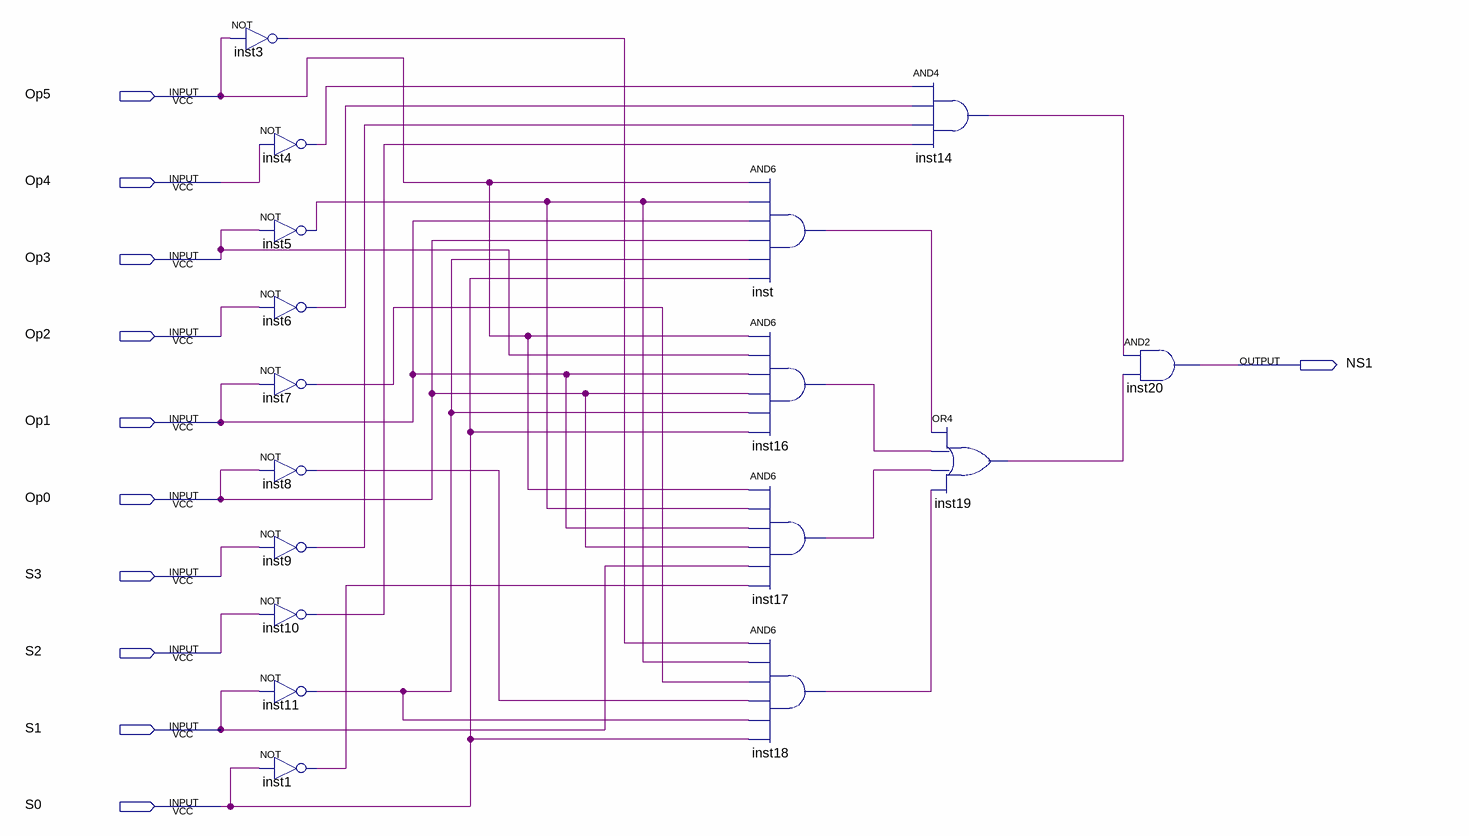
[diagram p0: schematic sheet]
// Quartus schematic NS1.bdf as structural Verilog: 17 symbols, 11 pins
module NS1 (
  input  Op5,
  input  Op4,
  input  Op3,
  input  Op2,
  input  Op1,
  input  Op0,
  input  S3,
  input  S2,
  input  S1,
  input  S0,
  output NS1
);

  wire inst1_out, inst3_out, inst4_out, inst5_out, inst6_out, inst7_out, inst8_out, inst9_out, inst10_out,
       inst11_out, inst14_out, inst16_out, inst17_out, inst18_out, inst19_out, inst_out;

  not inst3 (inst3_out, Op5);
  not inst4 (inst4_out, Op4);
  not inst5 (inst5_out, Op3);
  not inst6 (inst6_out, Op2);
  not inst7 (inst7_out, Op1);
  not inst8 (inst8_out, Op0);
  not inst9 (inst9_out, S3);
  not inst10 (inst10_out, S2);
  not inst11 (inst11_out, S1);
  not inst1 (inst1_out, S0);
  and inst (inst_out, Op5, inst5_out, Op1, Op0, inst11_out, S0);
  and inst16 (inst16_out, Op5, Op3, Op1, Op0, inst11_out, S0);
  and inst17 (inst17_out, Op5, inst5_out, Op1, Op0, S1, inst1_out);
  and inst18 (inst18_out, inst3_out, inst5_out, inst7_out, inst8_out, inst11_out, S0);
  and inst14 (inst14_out, inst4_out, inst6_out, inst9_out, inst10_out);
  or inst19 (inst19_out, inst_out, inst16_out, inst17_out, inst18_out);
  and inst20 (NS1, inst14_out, inst19_out);
endmodule
